# Altium schematic sheet 1X 4LED.SCHDOC
size B; SheetNumber: 0; SheetTotal: 0
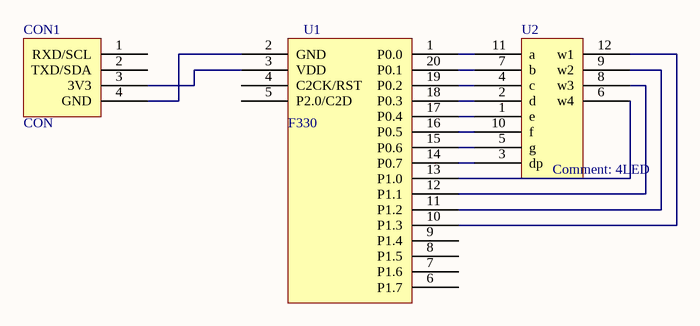
[diagram p0: 1X 4LED.SCHDOC]

## Parts
CON1  CON  [PH-SIDE]
U1  F330  [QFN20]
U2  4LED  [4LED]

## Nets
NetCON1_3: CON1.3(3V3) U1.3(VDD)
NetCON1_4: CON1.4(GND) U1.2(GND)
NetU1_1: U1.1(P0.0) U2.11(a)
NetU1_10: U1.10(P1.3) U2.12(w1)
NetU1_11: U1.11(P1.2) U2.9(w2)
NetU1_12: U1.12(P1.1) U2.8(w3)
NetU1_13: U1.13(P1.0) U2.6(w4)
NetU1_14: U1.14(P0.7) U2.3(dp)
NetU1_15: U1.15(P0.6) U2.5(g)
NetU1_16: U1.16(P0.5) U2.10(f)
NetU1_17: U1.17(P0.4) U2.1(e)
NetU1_18: U1.18(P0.3) U2.2(d)
NetU1_19: U1.19(P0.2) U2.4(c)
NetU1_20: U1.20(P0.1) U2.7(b)

Not connected (* = marked no-connect by the designer): CON1 1(RXD/SCL) 2(TXD/SDA); U1 4(C2CK/RST) 5(P2.0/C2D) 6(P1.7) 7(P1.6) 8(P1.5) 9(P1.4)